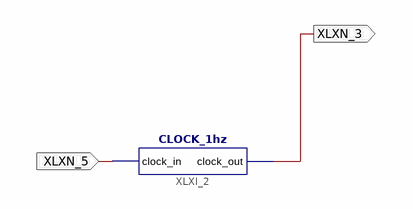
[diagram p0: schematic sheet 1]
// Xilinx ISE schematic testSR.sch (spartan6) as structural Verilog: 1 symbols, 2 ports
module testSR (
  input  XLXN_5,
  output XLXN_3
);

  CLOCK_1hz XLXI_2 (.clock_in(XLXN_5), .clock_out(XLXN_3));
endmodule
